# EAGLE design Kickliter_Trevor_Lab_9 (EAGLE 9.6.1)
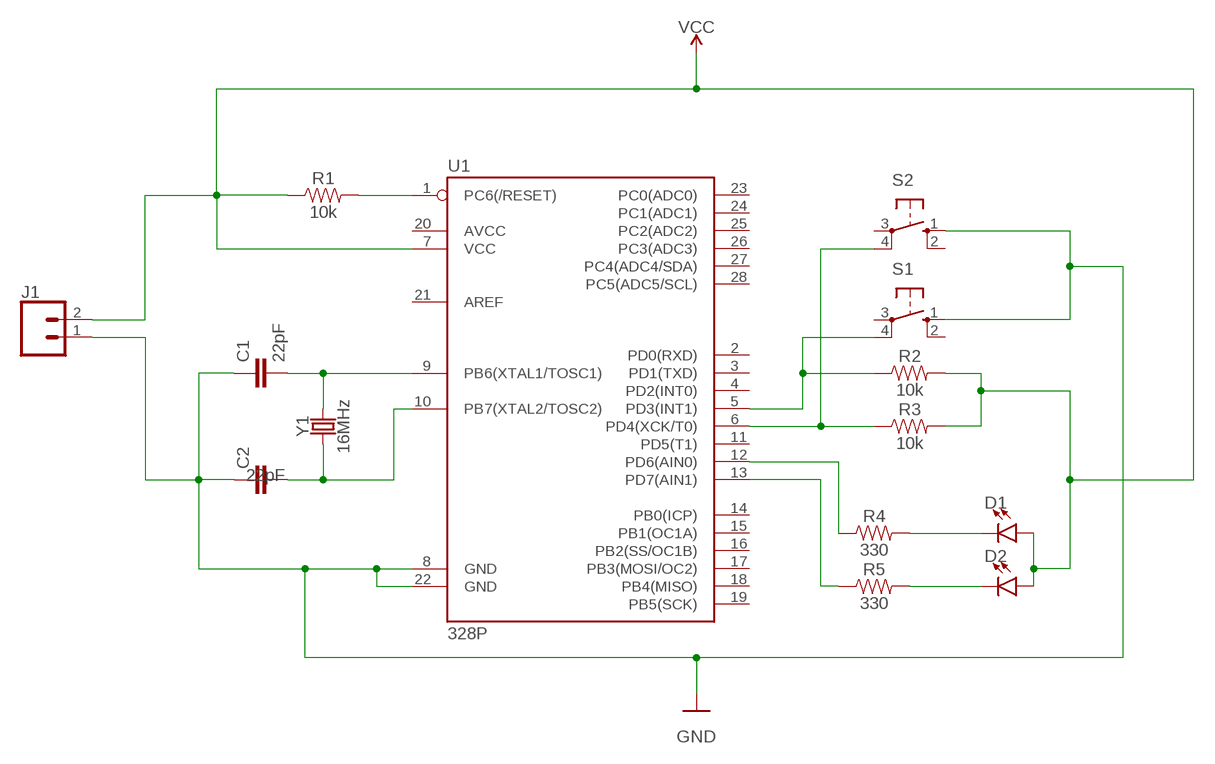
[diagram p0: schematic, sheet 1]

## Parts
C1  22pF  22PF-PTH-2.54MM-200V-5%  [CAP-PTH-2.54]
C2  22pF  22PF-PTH-2.54MM-200V-5%  [CAP-PTH-2.54]
D1  LED-3MM-NO_SILK  [LED_3MM-NS]
D2  LED-3MM-NO_SILK  [LED_3MM-NS]
J1  CONN_02  [1X02]
R1  10k  10KOHM-HORIZ-1/4W-5%  [AXIAL-0.3]
R2  10k  10KOHM-HORIZ-1/4W-1%  [AXIAL-0.3]
R3  10k  10KOHM-HORIZ-1/4W-1%  [AXIAL-0.3]
R4  330  330OHM-HORIZ-1/10W-5%  [AXIAL-0.3]
R5  330  330OHM-HORIZ-1/10W-5%  [AXIAL-0.3]
S1  10-XX  [B3F-10XX]
S2  10-XX  [B3F-10XX]
U1  328P  ATMEGA328P_PDIP  [DIP28]
Y1  16MHz  CRYSTAL-16MHZPTH-HC49US  [HC49US]

## Nets
GND: C1.1 C2.1 J1.1 S1.1(S) S2.1(S) U1.8(GND) U1.22(GND)
N$1: R1.P$2 U1.1(PC6(/RESET))
N$2: C1.2 U1.9(PB6(XTAL1/TOSC1)) Y1.2
N$3: R4.P$1 U1.12(PD6(AIN0))
N$4: C2.2 U1.10(PB7(XTAL2/TOSC2)) Y1.1
N$5: D1.K(C) R4.P$2
N$6: R5.P$1 U1.13(PD7(AIN1))
N$7: D2.K(C) R5.P$2
N$9: R2.P$1 S1.4(P1) U1.5(PD3(INT1))
N$10: R3.P$1 S2.4(P1) U1.6(PD4(XCK/T0))
VCC: D1.A D2.A J1.2 R1.P$1 R2.P$2 R3.P$2 U1.7(VCC)
Unconnected: S1.2(S1) S1.3(P) S2.2(S1) S2.3(P) U1.2(PD0(RXD)) U1.3(PD1(TXD)) U1.4(PD2(INT0)) U1.11(PD5(T1)) U1.14(PB0(ICP)) U1.15(PB1(OC1A)) U1.16(PB2(SS/OC1B)) U1.17(PB3(MOSI/OC2)) U1.18(PB4(MISO)) U1.19(PB5(SCK)) U1.20(AVCC) U1.21(AREF) U1.23(PC0(ADC0)) U1.24(PC1(ADC1)) U1.25(PC2(ADC2)) U1.26(PC3(ADC3)) U1.27(PC4(ADC4/SDA)) U1.28(PC5(ADC5/SCL))

## Library data of the parts
C1 C2 = SparkFun-Capacitors:22PF: 22pF ceramic capacitors A capacitor is a passive two-terminal electrical component used to store electrical energy temporarily in an electric field.; PROD_ID: CAP-09128
D1 D2 = SparkFun-LED:LED: LED (Generic) Standard schematic elements and footprints for 5mm, 3mm, 1206, and 0603 sized LEDs. Generic LEDs with no color specified.
J1 = SparkFun-Connectors:CONN_02: Multi connection point. Often used as Generic Header-pin footprint for 0.1 inch spaced/style header connections On any of the 0.1 inch spaced packages, you can populate with these: Break Away Headers - Straight <https://www.sparkfun.com/products/116> (PRT-00116) Break Away Male Headers - Right Angle <https://www.sparkfun.com/products/553> (PRT-00553) Female Headers <https://www.sparkfun.com/products/115> (PRT-00115) Break Away Headers - Machine Pin <https://www.sparkfun.com/products/117> (PRT-00117) Break Away Female Headers - Swiss Machine Pin <https://www.sparkfun.com/products/743> (PRT-00743) For SCREWTERMINALS and SPRING TERMINALS visit here: Screw Terimnals on SparkFun.com <https://www.sparkfun.com/search/results?term=Screw+Terminals> (5mm/3.5mm/2.54mm spacing) This device is also useful as a general connection point to wire up your design to another part of your project. Our various solder wires solder well into these plated through hole pads. Hook-Up Wire - Assortment (Stranded, 22 AWG) <https://www.sparkfun.com/products/11375> (PRT-11375) Hook-Up Wire - Assortment (Solid Core, 22 AWG) <https://www.sparkfun.com/products/11367> (PRT-11367) View the entire wire category on our website here <https://www.sparkfun.com/categories/141> Special notes: Molex polarized connector foot print use with: PRT-08233 with associated crimp pins and housings. 2.54_SCREWTERM for use with PRT-10571. 3.5mm Screw Terminal footprints for PRT-08084 5mm Screw Terminal footprints for use with PRT-08432
R1 = SparkFun-Resistors:10KOHM: 10kΩ resistor A resistor is a passive two-terminal electrical component that implements electrical resistance as a circuit element. Resistors act to reduce current flow, and, at the same time, act to lower voltage levels within circuits. - Wikipedia; PROD_ID: RES-09435
R2 R3 = SparkFun-Resistors:10KOHM: 10kΩ resistor A resistor is a passive two-terminal electrical component that implements electrical resistance as a circuit element. Resistors act to reduce current flow, and, at the same time, act to lower voltage levels within circuits. - Wikipedia; PROD_ID: RES-12183
R4 R5 = SparkFun-Resistors:330OHM: 330Ω resistor A resistor is a passive two-terminal electrical component that implements electrical resistance as a circuit element. Resistors act to reduce current flow, and, at the same time, act to lower voltage levels within circuits. - Wikipedia; PROD_ID: RES-8371
S1 S2 = switch-omron:10-XX: OMRON SWITCH; MPN: B3F-1000; OC_FARNELL: 176432; OC_NEWARK: 36M3542
U1 = SparkFun-IC-Microcontroller:ATMEGA328P_PDIP: Atmel 328P Through hole ATMEGA328P uC used in the Arduino 32kb flash, 1k EEPROM, 2k SRAM Datasheet <http://www.sparkfun.com/datasheets/Components/SMD/ATMega328.pdf> SparkFun Products Storefront component: AVR 28 Pin 20MHz 32K 6A/D - ATMega328P <https://www.sparkfun.com/products/9061> (COM-09061) SparkFun Simon Says - Through-Hole Soldering Kit <https://www.sparkfun.com/products/10547> (KIT-10547) SparkFun Learn to Solder - Simon Says <https://www.sparkfun.com/products/13708> (KIT-13708) SparkFun BigTime Watch Kit <https://www.sparkfun.com/products/11734> (KIT-11734) SparkFun ClockIt <https://www.sparkfun.com/products/10930> (KIT-10930) SparkFun Serial Enabled LCD Kit <https://www.sparkfun.com/products/10097> (LCD-10097) SparkFun Simon Tilts - Through Hole Soldering Kit <https://www.sparkfun.com/products/12634> (KIT-12634) SparkFun Frequency Counter Kit <https://www.sparkfun.com/products/10140> (KIT-10140) FabFM Radio Kit <https://www.sparkfun.com/products/11043> (KIT-11043) SparkFun Binary Blaster Kit <https://www.sparkfun.com/products/12037> (KIT-12037) SparkFun Metro-Gnome <https://www.sparkfun.com/products/9236> (KIT-09236) ATmega328 with Arduino Optiboot (Uno) <https://www.sparkfun.com/products/10524> (DEV-10524); PROD_ID: IC-09136
Y1 = SparkFun-Clocks:CRYSTAL-16MHZ: 16MHz Crystal Digikey Example <http://www.digikey.com/product-search/en?keywords=535-9122-1-ND> Frequency: 16MHz Frequency Stability: ±50ppm Frequency Tolerance: ±20ppm Load Capacitance: 18pF SparkFun Products: Pro Micro -5V/16MHz <https://www.sparkfun.com/products/12640> SparkFun Serial Enabled LCD Kit <https://www.sparkfun.com/products/10097>; PROD_ID: XTAL-08181; SF_ID: COM-00536

## Board
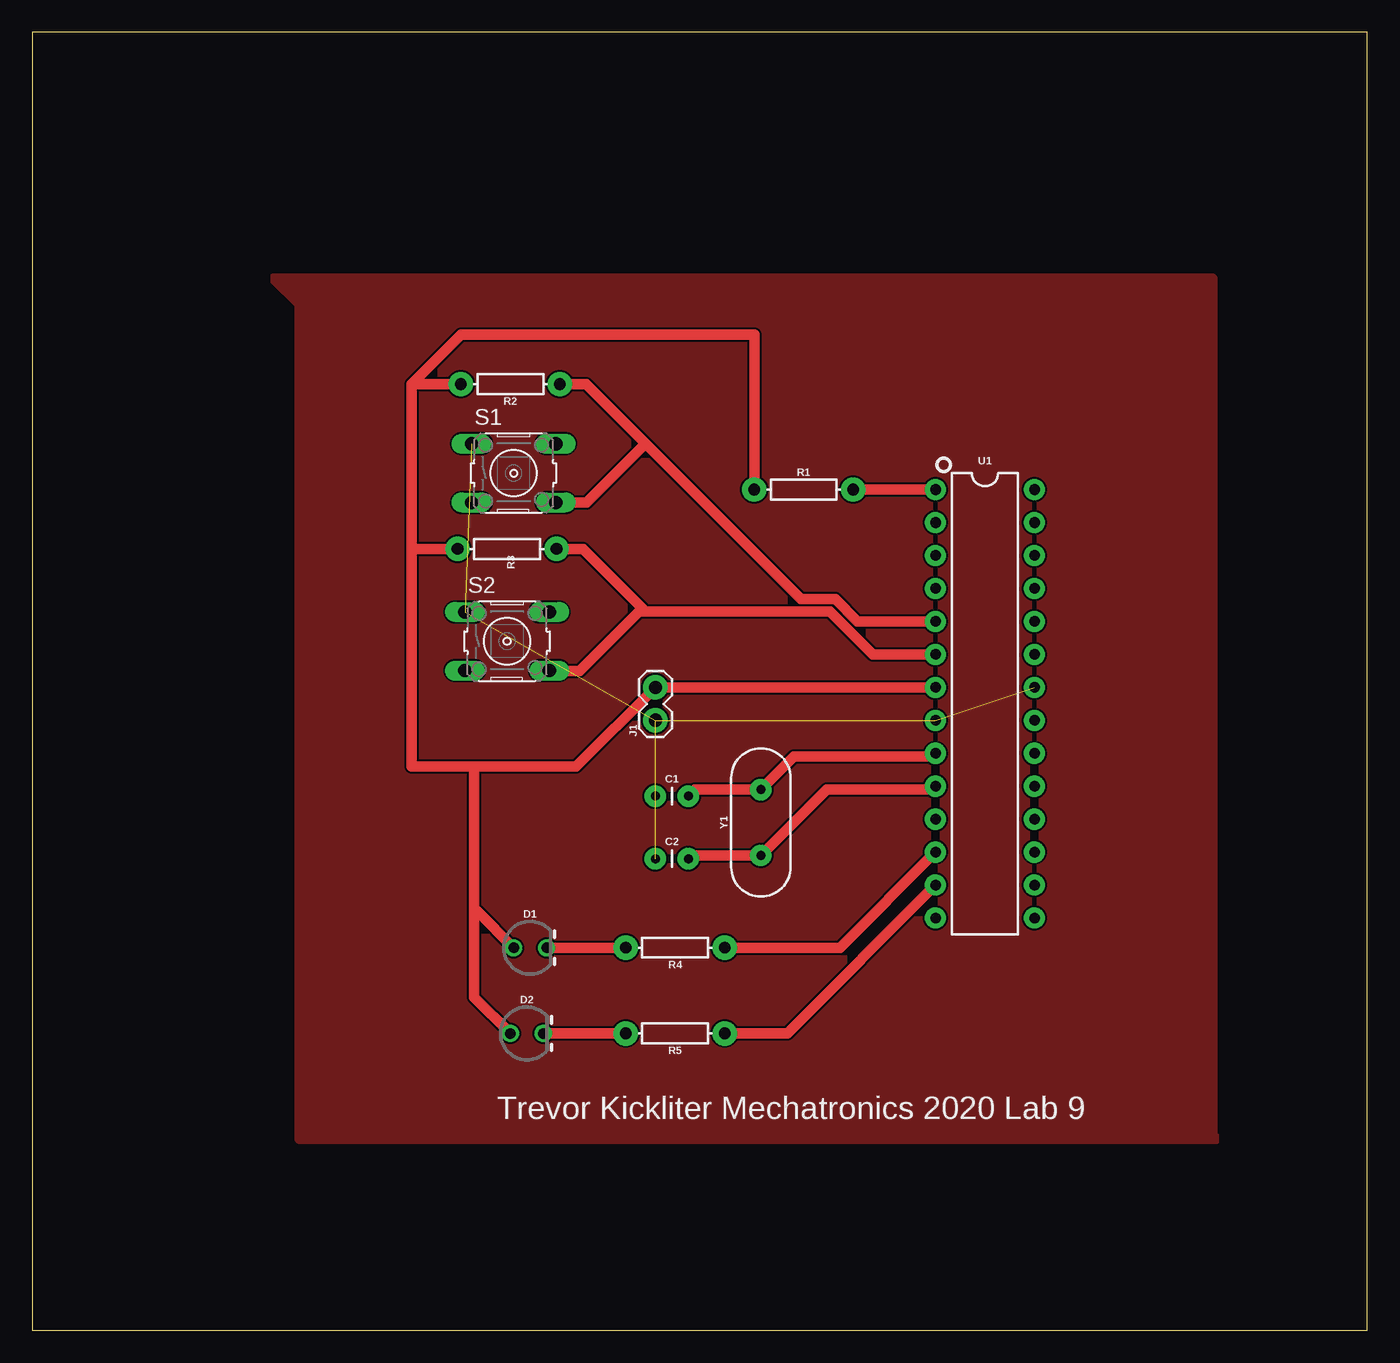
[diagram p1: board, top side]

Size 102.85 x 100 mm. Coordinates in mm from the lower left corner, seen from the top.
Outline: 0,0 102.85,0 102.85,100 0,100 0,0
Copper layers (1*16): Top 0.035mm / dielectric 1.5mm / Bottom 0.035mm
Design rules "default": minimum track width 6mil, minimum drill 0.35mm, track to track 6mil, track to pad 6mil, pad to pad 6mil, via to via 6mil, smd to smd 6mil, copper to edge 40mil, drill to drill 6mil, minimum pad ring 10mil, minimum via ring 8mil, stop-mask expansion 4mil, vias tented up to drill 0mil, thermal gap 10mil

### Footprints (pad centres in the part's own frame; a part is rotated, then mirrored left to right if it is on the bottom)
CAP-PTH-2.54 = drill 0.7 pad 1.651: 1 -1.27,0; 2 1.27,0
LED_3MM-NS = drill 0.813: A -1.27,0; K 1.27,0
1X02 = drill 1.016 pad 1.88: 1 0,0; 2 2.54,0
AXIAL-0.3 = drill 0.9 pad 1.88: P$1 -3.81,0; P$2 3.81,0
B3F-10XX = drill 1.016 long: 1 -3.251,2.261; 2 3.251,2.261; 3 -3.251,-2.261; 4 3.251,-2.261
DIP28 = drill 0.813 pad 1.626: 1 -16.51,-3.81; 2 -13.97,-3.81; 3 -11.43,-3.81; 4 -8.89,-3.81; 5 -6.35,-3.81; 6 -3.81,-3.81; 7 -1.27,-3.81; 8 1.27,-3.81; 9 3.81,-3.81; 10 6.35,-3.81; 11 8.89,-3.81; 12 11.43,-3.81; 13 13.97,-3.81; 14 16.51,-3.81; 15 16.51,3.81; 16 13.97,3.81; 17 11.43,3.81; 18 8.89,3.81; 19 6.35,3.81; 20 3.81,3.81; 21 1.27,3.81; 22 -1.27,3.81; 23 -3.81,3.81; 24 -6.35,3.81; 25 -8.89,3.81; 26 -11.43,3.81; 27 -13.97,3.81; 28 -16.51,3.81
HC49US = drill 0.7 pad 1.651: 1 -2.54,0; 2 2.54,0

### Placement (x,y rotation side)
C1  49.28,41.15 0 top
C2  49.28,36.32 0 top
D1  38.35,29.46 0 top
D2  38.1,22.86 0 top
J1  48.01,46.99 90 top
R1  59.44,64.77 0 top
R2  36.83,72.9 180 top
R3  36.58,60.2 180 top
R4  49.53,29.46 180 top
R5  49.53,22.86 180 top
S1  37.08,66.04 0 top
S2  36.58,53.09 0 top
U1  73.41,48.26 270 top
Y1  56.13,39.12 90 top

### Tracks (layer width: path | path; a pad name or v marks a point on that pad's centre or on a via)
GND  (6 unrouted)
GNDPLANE
  pour Top: 18.61,81.03 90.93,81.03 90.93,14.99 91.19,14.73 20.57,14.73 20.57,79.06
N$1
  Top 0.813: R1.P$2 U1.1
N$2
  Top 0.813: U1.9 69.34,44.2 58.67,44.2 Y1.2 51.05,41.66 C1.2
N$3
  Top 0.813: R4.P$1 62.23,29.46 U1.12
N$4
  Top 0.813: U1.10 69.34,41.66 61.21,41.66 Y1.1 50.8,36.58 C2.2
N$5
  Top 0.813: D1.K R4.P$2
N$6
  Top 0.813: U1.13 58.17,22.86 R5.P$1
N$7
  Top 0.813: D2.K R5.P$2
N$9
  Top 0.813: 47.24,68.33 42.67,72.9 R2.P$1 | 47.24,68.33 42.7,63.78 S1.4 | 47.24,68.33 59.23,56.34 61.87,56.34 63.59,54.61 U1.5
N$10
  Top 0.813: 47.24,55.37 42.42,60.2 R3.P$1 | U1.6 64.77,52.07 61.47,55.37 47.24,55.37 | 47.24,55.37 46.74,55.37 42.16,50.8 39.85,50.8 S2.4
VCC
  Top 0.813: U1.7 J1.2 41.91,43.43 34.04,43.43 | 34.04,43.43 29.21,43.43 29.21,59.94 | 29.21,59.94 29.21,72.9 | R2.P$2 29.21,72.9 | R3.P$2 29.46,60.2 29.21,59.94 | 29.21,72.9 33.02,76.71 55.63,76.71 R1.P$1 | 34.04,43.43 34.04,32.26 | 34.04,32.26 34.04,25.65 D2.A | D1.A 34.29,32.26 34.04,32.26

### Text on the board
tSilk: Trevor Kickliter Mechatronics 2020 Lab 9